# Altium schematic sheet RS485.SchDoc
size A3; SheetNumber: 4; SheetTotal: 6
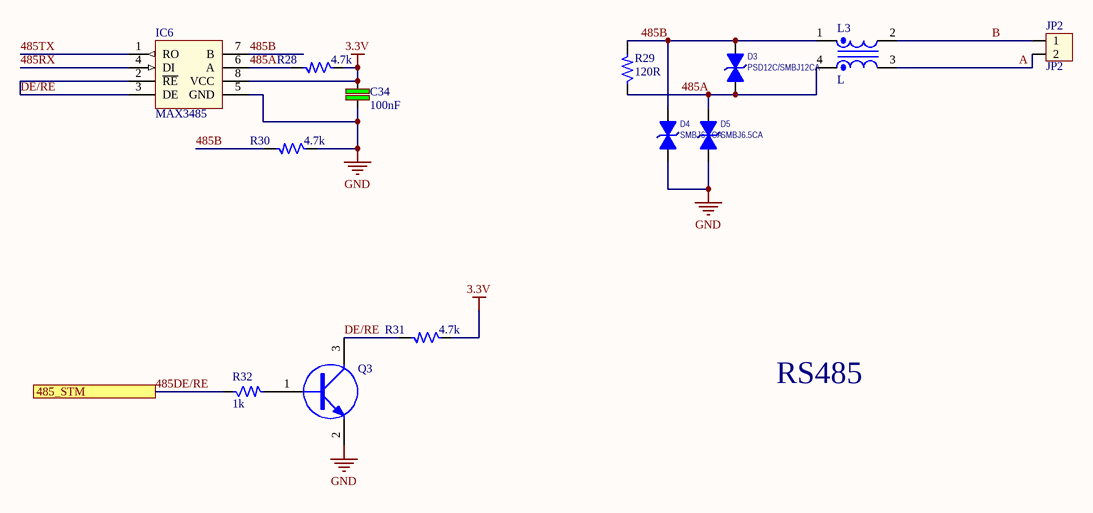
[diagram p0: RS485.SchDoc]

## Parts
C34  100nF  [C-0805]
D3  PSD12C/SMBJ12CA  [SOD323 - DO241]
D4  SMBJ6.5CA  [TVS]
D5  SMBJ6.5CA  [TVS]
IC6  MAX3485  [SOIC-8]
JP2  JP2  [KF2-5.08]
L3  L  [CMC 51UH 800MA 2LN SMD AEC-Q200]
Q3  C1815(MMBT4401)  [SOT23]  (value not drawn)
R28  4.7k  [R-0805]
R29  120R  [R-0805]
R30  4.7k  [R-0805]
R31  4.7k  [R-0805]
R32  1k  [R-0805]

## Ports
485_STM

## Nets
3.3V: C34.1 IC6.8(VCC) R28.1 R31.1
GND: C34.2 D4.1(A) D5.1(A) IC6.5(GND) Q3.2(E) R30.1
485A: D3.1(A) D5.2(K) IC6.6(A) L3.4 R28.2 R29.1
485B: D3.2(K) D4.2(K) IC6.7(B) L3.1 R29.2 R30.2
485DE/RE: R32.1 ; port 485_STM
485RX: IC6.4(DI)
485TX: IC6.1(RO)
A: JP2.2 L3.3
B: JP2.1 L3.2
DE/RE: IC6.2(~{RE}) IC6.3(DE) Q3.3(C) R31.2
NetQ3_1: Q3.1(B) R32.2

## Notes on the sheet
- RS485

## Library data of the parts
C34 = C: Cap SMD; Manufacturer: Samsung Electro-Mechanics; Part number: CL21B104KBCNNWC; User_Description: CAP CER 0.1UF 50V X7R 0805; Value: 100nF; Category: CAPACITOR; Package: 0805
D3-D5 = SMAJ30CA-30V/8.3A: TVS DIODE 30VWM 48.4VC SMA; Manufacturer: Bourns Inc.; Part number: PSD12C; Category: Circuit Protection; Package: SOD323; User_Description: TVS DIODE 30VWM 48.4VC SMA
IC6 = MAX3362EKA+T: IC TRANSCEIVER HALF 1/1 SOT23-8; Manufacturer: Maxim Integrated; Category: Interface - Drivers; Package: SOT-23-8; User_Description: IC TRANSCEIVER HALF 1/1 SOT23-8; Part number: MAX3362EKA+T
JP2 = Con2: Connector 2; Value: Connector 2
L3 = L filter Common Mode Chokes: CMC 51UH 800MA 2LN SMD AEC-Q200; Manufacturer: EPCOS - TDK Electronics; Part number: B82793S0513N201; User_Description: CMC 51UH 800MA 2LN SMD AEC-Q200
Q3 = NPN: Transistor C1815, SOT23; Manufacturer: Fairchild Semiconductor; User_Description: 0.6A, 40V, NPN; Category: TRAN NPN; Package: SOT-23; Part number: MMBT4401
R28 R30 R31 = R: RES SMD 4.7K OHM 1% 1/8W 0805; Manufacturer: Yageo; Part number: RC0805FR-074K7L; Category: RESISTORS; Package: 0805; User_Description: RES SMD 4.7K OHM 1% 1/8W 0805; Value: 4.7k
R29 = R: Resistor 1/4W; Manufacturer: Yageo; Part number: RC0805FR-07120RL; User_Description: RES SMD 120 OHM 1% 1/8W 0805; Category: RESISTORS; Package: 0805; Value: 120R
R32 = R: Resistor 1/4W; Manufacturer: Yageo; Part number: RC0805FR-071KL; User_Description: RES SMD 1K OHM 1% 1/8W 0805; Category: RESISTORS; Package: 0805; Value: 1k